# Altium schematic sheet uSwitchCoder.SchDoc
size A4; SheetNumber: 1; SheetTotal: 1
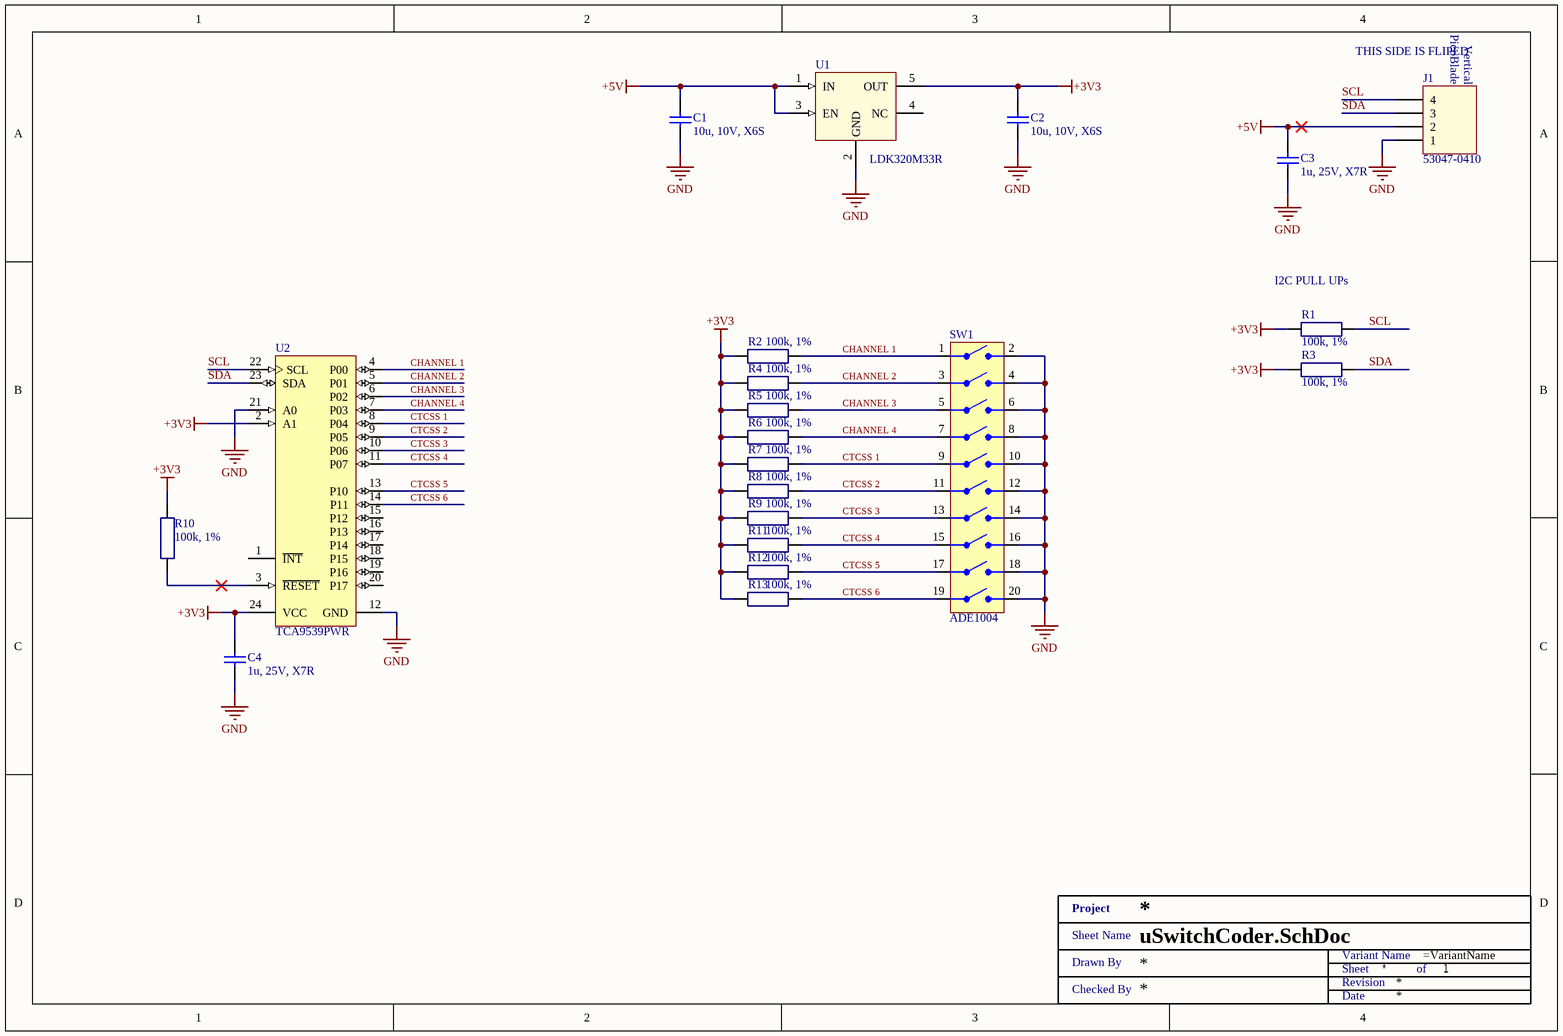
[diagram p0: uSwitchCoder.SchDoc]

## Parts
C1  10u, 10V, X6S  [SMD0603]
C2  10u, 10V, X6S  [SMD0603]
C3  1u, 25V, X7R  [SMD0603]
C4  1u, 25V, X7R  [SMD0603]
J1  53047-0410  [530470410]
R1  100k, 1%  [SMD0603 - R]
R2  100k, 1%  [SMD0603 - R]
R3  100k, 1%  [SMD0603 - R]
R4  100k, 1%  [SMD0603 - R]
R5  100k, 1%  [SMD0603 - R]
R6  100k, 1%  [SMD0603 - R]
R7  100k, 1%  [SMD0603 - R]
R8  100k, 1%  [SMD0603 - R]
R9  100k, 1%  [SMD0603 - R]
R10  100k, 1%  [SMD0603 - R]
R11  100k, 1%  [SMD0603 - R]
R12  100k, 1%  [SMD0603 - R]
R13  100k, 1%  [SMD0603 - R]
SW1  ADE1004  [ADE1004]
U1  LDK320M33R  [SOT23-5]
U2  TCA9539PWR  [PW0024A_M]
XX?  Title 1  (value not drawn)  (graphical)

## Nets
+3V3: C2.2 C4.1 R1.1 R2.1 R3.1 R4.1 R5.1 R6.1 R7.1 R8.1 R9.1 R10.1 R11.1 R12.1 R13.1 U1.5(OUT) U2.2(A1) U2.24(VCC)
+5V: C1.2 C3.1 J1.2 U1.1(IN) U1.3(EN)
GND: C1.1 C2.1 C3.2 C4.2 J1.1 SW1.2 SW1.4 SW1.6 SW1.8 SW1.10 SW1.12 SW1.14 SW1.16 SW1.18 SW1.20 U1.2(GND) U2.12(GND) U2.21(A0)
CHANNEL 1: R2.2 SW1.1 U2.4(P00)
CHANNEL 2: R4.2 SW1.3 U2.5(P01)
CHANNEL 3: R5.2 SW1.5 U2.6(P02)
CHANNEL 4: R6.2 SW1.7 U2.7(P03)
CTCSS 1: R7.2 SW1.9 U2.8(P04)
CTCSS 2: R8.2 SW1.11 U2.9(P05)
CTCSS 3: R9.2 SW1.13 U2.10(P06)
CTCSS 4: R11.2 SW1.15 U2.11(P07)
CTCSS 5: R12.2 SW1.17 U2.13(P10)
CTCSS 6: R13.2 SW1.19 U2.14(P11)
SCL: J1.4 R1.2 U2.22(SCL)
SDA: J1.3 R3.2 U2.23(SDA)
NetR10_2: R10.2 U2.3(~{RESET})

Not connected (* = marked no-connect by the designer): U1 4(NC); U2 1(~{INT}) 15(P12) 16(P13) 17(P14) 18(P15) 19(P16) 20(P17)

## Notes on the sheet
- (near J1) THIS SIDE IS FLIPED
- (near R1) I2C PULL UPs
- (in symbol 53047-0410) PicoBlade; Vertical
- (in symbol Title 1) Project; Sheet Name; Variant Name; Drawn By; Sheet; of; Revision; Checked By; Date

## Library data of the parts
C1 C2 = GRT188C81A106ME13D: Cap Ceramic 10uF 10V X6S 20% Pad SMD 0603 105C Automotive T/R; Manufacturer: Murata; Supplier 1: Mouser; Supplier Part Number 1: 81-GRT188C81A106ME3D; Manufacturer Part Number: GRT188C81A106ME13D; RoHS: No; Category: Ceramic Capacitors; Stock 1: 1862; Pricing 1: 1=0.41000, 10=0.20100, 50=0.20100, 100=0.17200, 1000=0.10900, 10000=0.09700 (USD); Mount: Surface Mount; Case/Package: 0603; Case Code (Metric): 1608; Case Code (Imperial): 0603; Min Operating Temperature: -55°C; Max Operating Temperature: 105°C; Packaging: Tape and Reel; Capacitance: 10uF; Voltage Rating: 10V; Tolerance: 20%; Length: 0.063inch; Width: 0.031inch; Thickness: 0.035inch; Ratings: AEC-Q200; ComponentLink1URL: http://search.murata.co.jp/Ceramy/image/img/A01X/G101/ENG/GRT188C81A106ME13-01.pdf?src-supplier=Digi-Key; ComponentLink1Description: http://search.murata.co.jp/Ceramy/image/img/A01X/G101/ENG/GRT188C81A106ME13-01.pdf?src-supplier=Digi-Key; Supplier 2: Farnell; Supplier Part Number 2: 3582904; Supplier 3: Digi-Key; Supplier Part Number 3: 490-12283-6-ND
C3 C4 = CGA3E1X7R1E105K080AC: CAP CER 1UF 25V X7R 0603; Manufacturer: TDK Corporation; Tolerance: ±10%; Manufacturer Part Number: CGA3E1X7R1E105K080AC; RoHS: RoHS Compliant; Category: Capacitors; Stock 1: 109509; Pricing 1: 1=0.2, 10=0.135, 100=0.0686, 500=0.04696, 1000=0.04154 (USD); Packaging: Cut Tape (CT); Part Status: Active; Voltage - Rated: 25V; Temperature Coefficient: X7R; Operating Temperature: -55°C ~ 125°C; Features: -; Ratings: AEC-Q200; Applications: Automotive; Failure Rate: -; Mounting Type: Surface Mount, MLCC; Package / Case: 0603 (1608 Metric); Size / Dimension: 0.063" L x 0.032" W (1.60mm x 0.80mm); Height - Seated (Max): -; Thickness (Max): 0.035" (0.90mm); Lead Spacing: -; Lead Style: -; ComponentLink1URL: https://product.tdk.com/info/en/catalog/datasheets/mlcc_automotive_general_en.pdf; ComponentLink1Description: https://product.tdk.com/info/en/catalog/datasheets/mlcc_automotive_general_en.pdf; Capacitance: 1u; Supplier 1: Mouser; Supplier Part Number 1: 810-CGA3E1X7R1E105K; Supplier 2: Farnell; Supplier Part Number 2: 2346962; Supplier 3: Digi-Key; Supplier Part Number 3: 445-6931-1-ND
J1 = 53047-0410: 1.25mm Pitch, PicoBlade PCB Header, Single Row, Vertical, Through Hole, Tin Plating, Friction Lock, 4 Circuits, Tray, 2.30mm PC Tail Length; Manufacturer: Molex; Manufacturer Part Number: 0530470410; Number of Positions: 4; Max Voltage Rating (AC): 125V; Contact Resistance: 20mR; Connector Type: Blade Pin; RoHS: Yes; Category: Headers and Wire Housings; Stock 4: 7971; Pricing 4: 1=0,27000, 10=0,23400, 100=0,18000, 500=0,15400, 1000=0,13000, 5000=0,11200, 10000=0,10400 (USD); Mount: Through Hole; Housing Material: Nylon; Contact Plating: Tin; Contact Material: Bronze; Color: Natural; Housing Color: White; Min Operating Temperature: -40°C; Max Operating Temperature: 85°C; Termination: Solder; Number of Contacts: 4; Packaging: Tray; Number of Rows: 1; Orientation: Straight; Length: 6.75mm; Pitch: 1.25mm; Contact Mating Length: 0.089inch; Depth: 3.2mm; ComponentLink1URL: https://datasheet.ciiva.com/3934/87920530470410-pcb-headers-3934064.pdf?src-supplier=Arrow; ComponentLink1Description: https://datasheet.ciiva.com/3934/87920530470410-pcb-headers-3934064.pdf?src-supplier=Arrow; Supplier 1: Mouser; Supplier Part Number 1: 538-53047-0410; Supplier 2: Farnell; Supplier Part Number 2: 9733060; Supplier 3: Digi-Key; Supplier Part Number 3: WM1733-ND; Supplier 4: Avnet; Supplier Part Number 4: 0530470410
R1-R13 = RC0603FR-07100KL: RES SMD 100K OHM 1% 1/10W 0603; Manufacturer: Yageo; Power (Watts): 0.1W, 1/10W; Temperature Coefficient: ±100ppm/°C; Manufacturer Part Number: RC0603FR-07100KL; RoHS: RoHS Compliant; Category: Resistors; Stock 1: 14618646; Pricing 1: 1=0.1, 10=0.015, 100=0.006, 1000=0.00268, 2500=0.00233 (USD); Packaging: Cut Tape (CT); Part Status: Active; Tolerance: ±1%; Composition: Thick Film; Features: Moisture Resistant; Operating Temperature: -55°C ~ 155°C; Package / Case: 0603 (1608 Metric); Supplier Device Package: 0603; Size / Dimension: 0.063" L x 0.032" W (1.60mm x 0.80mm); Height - Seated (Max): 0.022" (0.55mm); Failure Rate: -; ComponentLink1URL: http://www.yageo.com/documents/recent/PYu-RC_Group_51_RoHS_L_8.pdf; ComponentLink1Description: http://www.yageo.com/documents/recent/PYu-RC_Group_51_RoHS_L_8.pdf; Resistance: 100k; Supplier 1: Mouser; Supplier Part Number 1: 603-RC0603FR-07100KL; Supplier 2: Farnell; Supplier Part Number 2: 9238727; Supplier 3: Digi-Key; Supplier Part Number 3: 311-100KHRCT-ND
SW1 = ADE1004: Switch DIP OFF ON SPST 10 Extended Slide 0.1A 24VDC PC Pins 2.54mm Thru-Hole Tube; Manufacturer: TE Connectivity; Actuator Material: Polyamide; Contact Resistance: 50mR; Number of Positions: 10; Electrical Life: 1000Cycles; Max Voltage Rating (DC): 24V; Power Rating: 400mW; Actuator Length: 1mm; Supplier 1: Mouser; Supplier Part Number 1: 506-ADE1004; Manufacturer Part Number: ADE1004; Stock 1: 19; Pricing 1: 1 = 1.62000, 10 = 1.53000, 25 = 1.37000, 50 = 1.37000, 100 = 1.34000, 250 = 1.18000, 500 = 1.12000, 1000 = 0.99600, 2500 = 0.93400, 5000 = 0.89000, 10000 = 0.89000 (USD); RoHS: Yes; Mount: Through Hole; Case/Package: DIP; Contact Material: Copper Alloy; Contact Plating: Gold; Min Operating Temperature: -30°C; Max Operating Temperature: 85°C; Package Quantity: 15; Throw Configuration: SPST; Packaging: Rail/Tube; Termination: Solder; Orientation: Straight; Switching Capacity: 400mW; Terminal Pitch: 2.54mm; Lead Free: Lead Free; ComponentLink1URL: https://datasheet.ciiva.com/5257/ng-cd-1825057-o2-147422-5257872.pdf?src-supplier=Mouser; ComponentLink1Description: https://datasheet.ciiva.com/5257/ng-cd-1825057-o2-147422-5257872.pdf?src-supplier=Mouser; ComponentLink2URL: https://datasheet.ciiva.com/24391/7365eng-cd-1825057-o2-24391238.pdf?src-supplier=Onlinecomponents.com; ComponentLink2Description: https://datasheet.ciiva.com/24391/7365eng-cd-1825057-o2-24391238.pdf?src-supplier=Onlinecomponents.com; Supplier 2: Digi-Key; Supplier Part Number 2: 1825057-9-ND; Stock 2: 3794; Pricing 2: 1 = 1.62000, 15 = 1.52600, 30 = 1.46400, 60 = 1.37050, 105 = 1.33933, 255 = 1.18357, 510 = 1.12129, 1005 = 0.99671, 5010 = 0.87212 (USD); Supplier 3: Arrow; Supplier Part Number 3: 1825057-9; Stock 3: 5100; Pricing 3: 3000 = 0.97080, 5010 = 0.90170, 1 = 1.75560, 15 = 1.50050, 30 = 1.42240, 60 = 1.32940, 105 = 1.27930, 255 = 1.12030, 510 = 1.05470, 1005 = 0.92500, 5010 = 0.83650 (USD); Supplier 4: Farnell; Supplier Part Number 4: 2468732; Stock 4: 514
U1 = LDK320M33R: IC REG LINEAR 200MA SOT23-5; Manufacturer: STMicroelectronics; Output Configuration: Positive; Output Type: Fixed; Voltage - Input (Max): 18V; Voltage - Output (Min/Fixed): 3.3V; Voltage Dropout (Max): 0.35V @ 200mA; PSRR: 88dB (120Hz); Control Features: Enable; Protection Features: Over Current, Over Temperature; Manufacturer Part Number: LDK320M33R; RoHS: RoHS Compliant; Category: Integrated Circuits (ICs); Stock 1: 5592; Pricing 1: 1=0.85, 10=0.748, 100=0.5733, 500=0.4532, 1000=0.36256 (USD); Packaging: Cut Tape (CT); Part Status: Active; Current - Output: 200mA; Operating Temperature: -40°C ~ 125°C (TJ); Mounting Type: Surface Mount; Package / Case: SC-74A, SOT-753; Supplier Device Package: SOT-23-5; ComponentLink1URL: http://www.st.com/content/ccc/resource/technical/document/datasheet/0e/0c/26/c9/a4/d4/4b/a1/DM00236470.pdf/files/DM00236470.pdf/jcr:content/translations/en.DM00236470.pdf; ComponentLink1Description: http://www.st.com/content/ccc/resource/technical/document/datasheet/0e/0c/26/c9/a4/d4/4b/a1/DM00236470.pdf/files/DM00236470.pdf/jcr:content/translations/en.DM00236470.pdf; Supplier 1: Mouser; Supplier Part Number 1: 511-LDK320M33R; Supplier 2: Farnell; Supplier Part Number 2: 3130011; Supplier 3: Digi-Key; Supplier Part Number 3: 497-17034-1-ND
U2 = CMP-0314-00251-2: Remote 16-Bit I2C and SMBus, Low-Power I/O Expander with Interrupt Output, Reset & Config. Register, 1.65 to 5.5 V, -40 to 85 degC, 24-pin TSSOP (PW), Green (RoHS & no Sb/Br); Manufacturer: Texas Instruments; Interrupt Output: Yes; SubFamily: I2C IO Expander; I2C Address: 1110 1xx; # of I/Os: 16; Max Frequency(kHz): 400; 5V Tolerant I/O: Yes; ComponentLink1Description: Datasheet; PartNumber: TCA9539PWR; Eco-Plan: Green (RoHS & no Sb/Br); Reset Input: Yes; ComponentLink2Description: Package Specification; Mounting Technology: Surface Mount; PackageReference: PW0024A; DatasheetVersion: SCPS202A; ComponentLink1URL: http://www.ti.com/general/docs/lit/getliterature.tsp?genericPartNumber=TCA9539&fileType=pdf; Vcc range(V): 1.65 to 5.5; Low Power: Yes; Code_JEDEC: MO-153; Configuration Registers: Yes; PackageVersion: revG, Feb-2011; PackageDescription: 24-Pin Thin Small Outline Package 0.65 mm Pitch; Push-Pull I/O Type: Yes; ComponentLink2URL: http://www.ti.com/litv/pdf/mpds177g